# EAGLE design board (EAGLE 5.11)
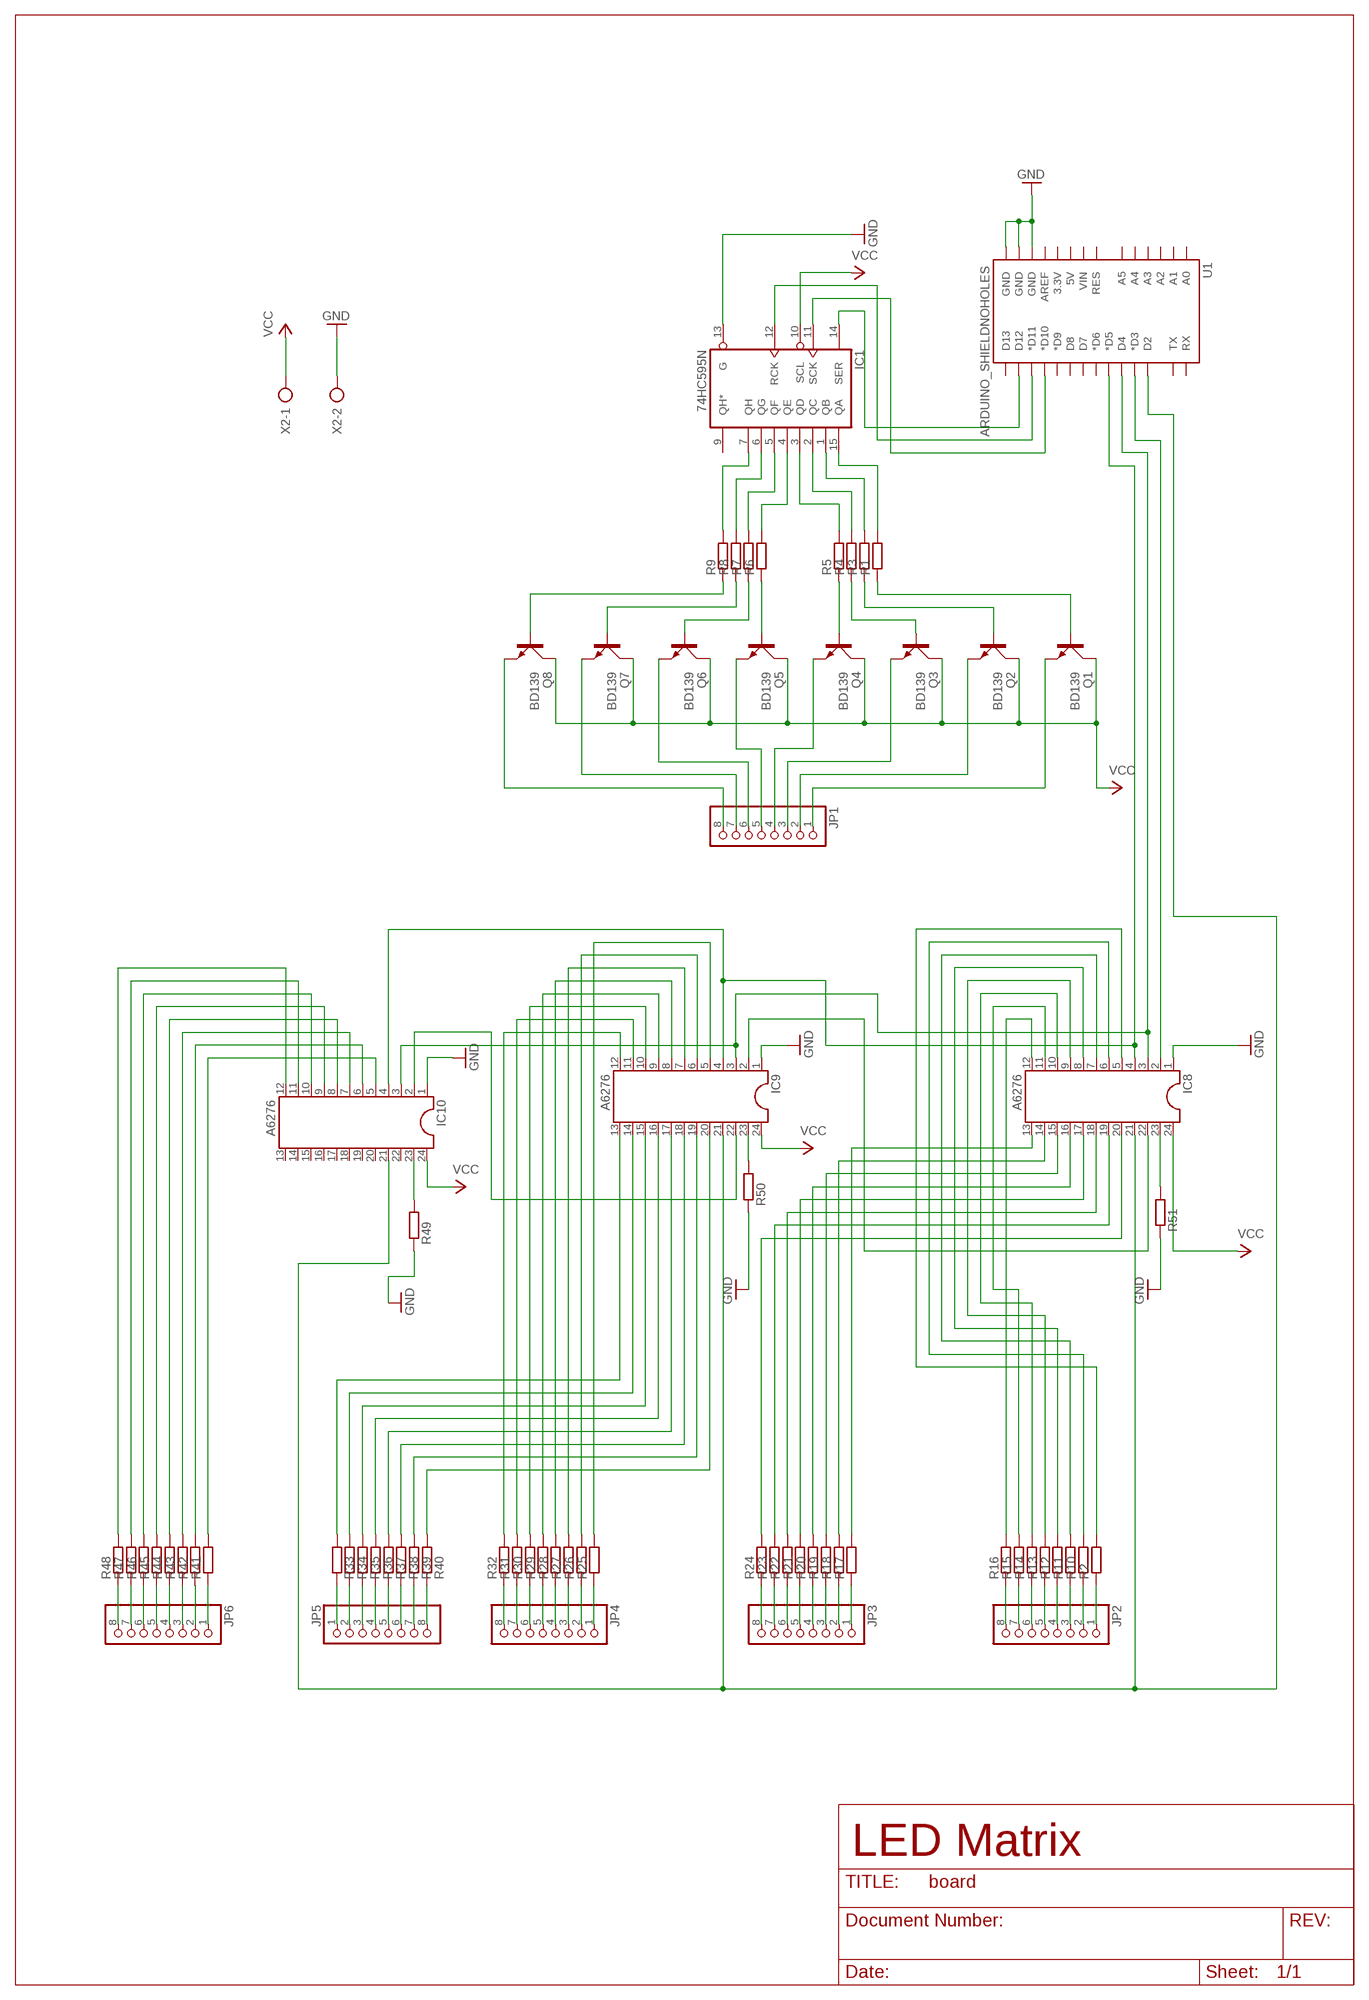
[diagram p0: schematic, sheet 1]

## Parts
IC1  74HC595N  [DIL16]
IC8  A6276  DIL24-3  [DIL24-3]
IC9  A6276  DIL24-3  [DIL24-3]
IC10  A6276  DIL24-3  [DIL24-3]
JP1  PINHD-1X8  [1X08]
JP2  PINHD-1X8  [1X08]
JP3  PINHD-1X8  [1X08]
JP4  PINHD-1X8  [1X08]
JP5  PINHD-1X8  [1X08]
JP6  PINHD-1X8  [1X08]
Q1  BD139  [TO126AV]
Q2  BD139  [TO126AV]
Q3  BD139  [TO126AV]
Q4  BD139  [TO126AV]
Q5  BD139  [TO126AV]
Q6  BD139  [TO126AV]
Q7  BD139  [TO126AV]
Q8  BD139  [TO126AV]
R1  R-EU_0204/7  [0204/7]
R2  R-EU_0204/7  [0204/7]
R3  R-EU_0204/7  [0204/7]
R4  R-EU_0204/7  [0204/7]
R5  R-EU_0204/7  [0204/7]
R6  R-EU_0204/7  [0204/7]
R7  R-EU_0204/7  [0204/7]
R8  R-EU_0204/7  [0204/7]
R9  R-EU_0204/7  [0204/7]
R10  R-EU_0204/7  [0204/7]
R11  R-EU_0204/7  [0204/7]
R12  R-EU_0204/7  [0204/7]
R13  R-EU_0204/7  [0204/7]
R14  R-EU_0204/7  [0204/7]
R15  R-EU_0204/7  [0204/7]
R16  R-EU_0204/7  [0204/7]
R17  R-EU_0204/7  [0204/7]
R18  R-EU_0204/7  [0204/7]
R19  R-EU_0204/7  [0204/7]
R20  R-EU_0204/7  [0204/7]
R21  R-EU_0204/7  [0204/7]
R22  R-EU_0204/7  [0204/7]
R23  R-EU_0204/7  [0204/7]
R24  R-EU_0204/7  [0204/7]
R25  R-EU_0204/7  [0204/7]
R26  R-EU_0204/7  [0204/7]
R27  R-EU_0204/7  [0204/7]
R28  R-EU_0204/7  [0204/7]
R29  R-EU_0204/7  [0204/7]
R30  R-EU_0204/7  [0204/7]
R31  R-EU_0204/7  [0204/7]
R32  R-EU_0204/7  [0204/7]
R33  R-EU_0204/7  [0204/7]
R34  R-EU_0204/7  [0204/7]
R35  R-EU_0204/7  [0204/7]
R36  R-EU_0204/7  [0204/7]
R37  R-EU_0204/7  [0204/7]
R38  R-EU_0204/7  [0204/7]
R39  R-EU_0204/7  [0204/7]
R40  R-EU_0204/7  [0204/7]
R41  R-EU_0204/7  [0204/7]
R42  R-EU_0204/7  [0204/7]
R43  R-EU_0204/7  [0204/7]
R44  R-EU_0204/7  [0204/7]
R45  R-EU_0204/7  [0204/7]
R46  R-EU_0204/7  [0204/7]
R47  R-EU_0204/7  [0204/7]
R48  R-EU_0204/7  [0204/7]
R49  R-EU_0204/7  [0204/7]
R50  R-EU_0204/7  [0204/7]
R51  R-EU_0204/7  [0204/7]
U1  ARDUINO_SHIELDNOHOLES  [DUEMILANOVE_SHIELD_NOHOLES]
X2  AK500/2  [AK500/2]

## Nets
GND: IC1.13(G) IC8.1 IC9.1 IC10.1 R49.1 R50.1 R51.1 U1.GND@0(GND) U1.GND@1(GND) U1.GND@2(GND) X2.2
N$1: Q1.B R1.1
N$2: JP1.1 Q1.E
N$3: Q2.B R3.1
N$4: Q3.B R4.1
N$5: Q4.B R5.1
N$6: Q5.B R6.1
N$7: Q6.B R7.1
N$8: Q7.B R8.1
N$9: Q8.B R9.1
N$10: JP1.2 Q2.E
N$11: JP1.3 Q3.E
N$12: JP1.4 Q4.E
N$14: JP1.5 Q5.E
N$15: JP1.6 Q6.E
N$16: JP1.7 Q7.E
N$17: JP2.1 R2.1
N$18: JP2.2 R10.1
N$19: JP2.3 R11.1
N$20: JP2.4 R12.1
N$21: JP2.5 R13.1
N$22: JP2.6 R14.1
N$23: JP2.7 R15.1
N$24: JP2.8 R16.1
N$25: JP3.1 R17.1
N$26: JP3.2 R18.1
N$27: JP3.3 R19.1
N$28: JP3.4 R20.1
N$29: JP3.5 R21.1
N$30: JP3.6 R22.1
N$31: IC8.19 R23.2
N$32: JP3.8 R24.1
N$33: JP4.1 R25.1
N$34: JP4.2 R26.1
N$35: JP4.3 R27.1
N$36: JP4.4 R28.1
N$37: JP4.5 R29.1
N$38: JP4.6 R30.1
N$39: JP4.7 R31.1
N$40: JP4.8 R32.1
N$41: JP5.1 R33.1
N$42: JP5.2 R34.1
N$43: JP5.3 R35.1
N$44: JP5.4 R36.1
N$45: JP5.5 R37.1
N$46: JP5.6 R38.1
N$47: JP5.7 R39.1
N$48: JP5.8 R40.1
N$49: JP6.1 R41.1
N$50: IC10.7 R43.2
N$51: JP6.3 R43.1
N$52: JP6.4 R44.1
N$53: JP6.5 R45.1
N$54: JP6.6 R46.1
N$55: JP6.7 R47.1
N$56: JP6.8 R48.1
N$57: IC8.22 IC9.2
N$58: IC9.22 IC10.2
N$59: IC10.23 R49.2
N$60: IC1.14(SER) U1.D12
N$61: IC9.23 R50.2
N$62: IC8.23 R51.2
N$63: IC1.11(SCK) U1.D10(*D10)
N$64: IC1.12(RCK) U1.D11(*D11)
N$65: IC1.7(QH) R9.2
N$67: IC1.15(QA) R1.2
N$69: IC1.2(QC) R4.2
N$70: IC1.3(QD) R5.2
N$72: IC1.6(QG) R8.2
N$76: IC8.4 IC9.4 IC10.4 U1.D5(*D5)
N$79: IC8.2 U1.D3(*D3)
N$84: IC8.7 R11.2
N$85: IC8.8 R12.2
N$86: IC8.9 R13.2
N$87: IC8.6 R10.2
N$88: IC8.5 R2.2
N$89: IC8.10 R14.2
N$90: IC8.11 R15.2
N$91: IC8.12 R16.2
N$92: IC9.5 R25.2
N$93: IC9.6 R26.2
N$94: IC9.7 R27.2
N$95: IC9.8 R28.2
N$96: IC9.9 R29.2
N$97: IC9.10 R30.2
N$98: IC9.11 R31.2
N$99: IC9.12 R32.2
N$100: IC8.13 R17.2
N$101: IC8.14 R18.2
N$102: IC8.15 R19.2
N$103: IC8.16 R20.2
N$104: IC8.17 R21.2
N$105: IC8.18 R22.2
N$106: JP3.7 R23.1
N$107: IC8.20 R24.2
N$108: IC9.13 R33.2
N$109: IC9.14 R34.2
N$110: IC9.15 R35.2
N$111: IC9.16 R36.2
N$112: IC9.17 R37.2
N$113: IC9.18 R38.2
N$114: IC9.19 R39.2
N$115: IC9.20 R40.2
N$116: IC10.8 R44.2
N$117: IC10.5 R41.2
N$118: IC10.9 R45.2
N$119: IC10.10 R46.2
N$120: IC10.11 R47.2
N$121: IC10.12 R48.2
N$122: IC10.6 R42.2
N$123: JP6.2 R42.1
N$132: JP1.8 Q8.E
N$134: IC1.4(QE) R6.2
N$136: IC1.1(QB) R3.2
N$138: IC8.21 IC9.21 IC10.21 U1.D2
N$141: IC1.5(QF) R7.2
N$146: IC8.3 IC9.3 IC10.3 U1.D4
VCC: IC1.10(SCL) IC8.24 IC9.24 IC10.24 Q1.C Q2.C Q3.C Q4.C Q5.C Q6.C Q7.C Q8.C X2.1
Unconnected: IC1.9(QH*) IC10.13 IC10.14 IC10.15 IC10.16 IC10.17 IC10.18 IC10.19 IC10.20 IC10.22 U1.3.3V U1.5V U1.A0 U1.A1 U1.A2 U1.A3 U1.A4 U1.A5 U1.AREF U1.D6(*D6) U1.D7 U1.D8 U1.D9(*D9) U1.D13 U1.RES U1.RX U1.TX U1.VIN

## Notes on the sheet
- LED Matrix

## Power pins joined to a net without a drawn wire
GND: IC1.8(GND)
VCC: IC1.16(VCC)

## Library data of the parts
IC1 = 74xx-eu:74*595: 8-bit SHIFT REGISTER, output latch
IC8-IC10 = ic-package:DIL24: Dual In Line
JP1-JP6 = pinhead:PINHD-1X8: PIN HEADER
Q1-Q8 = transistor-power:BD139: NPN TRANSISTOR
R1-R51 = rcl:R-EU_: RESISTOR, European symbol
U1 = SparkFun:ARDUINO_SHIELD
X2 = con-ptr500:AK500/2: CONNECTOR; OC_FARNELL: unknown; OC_NEWARK: unknown

## Board
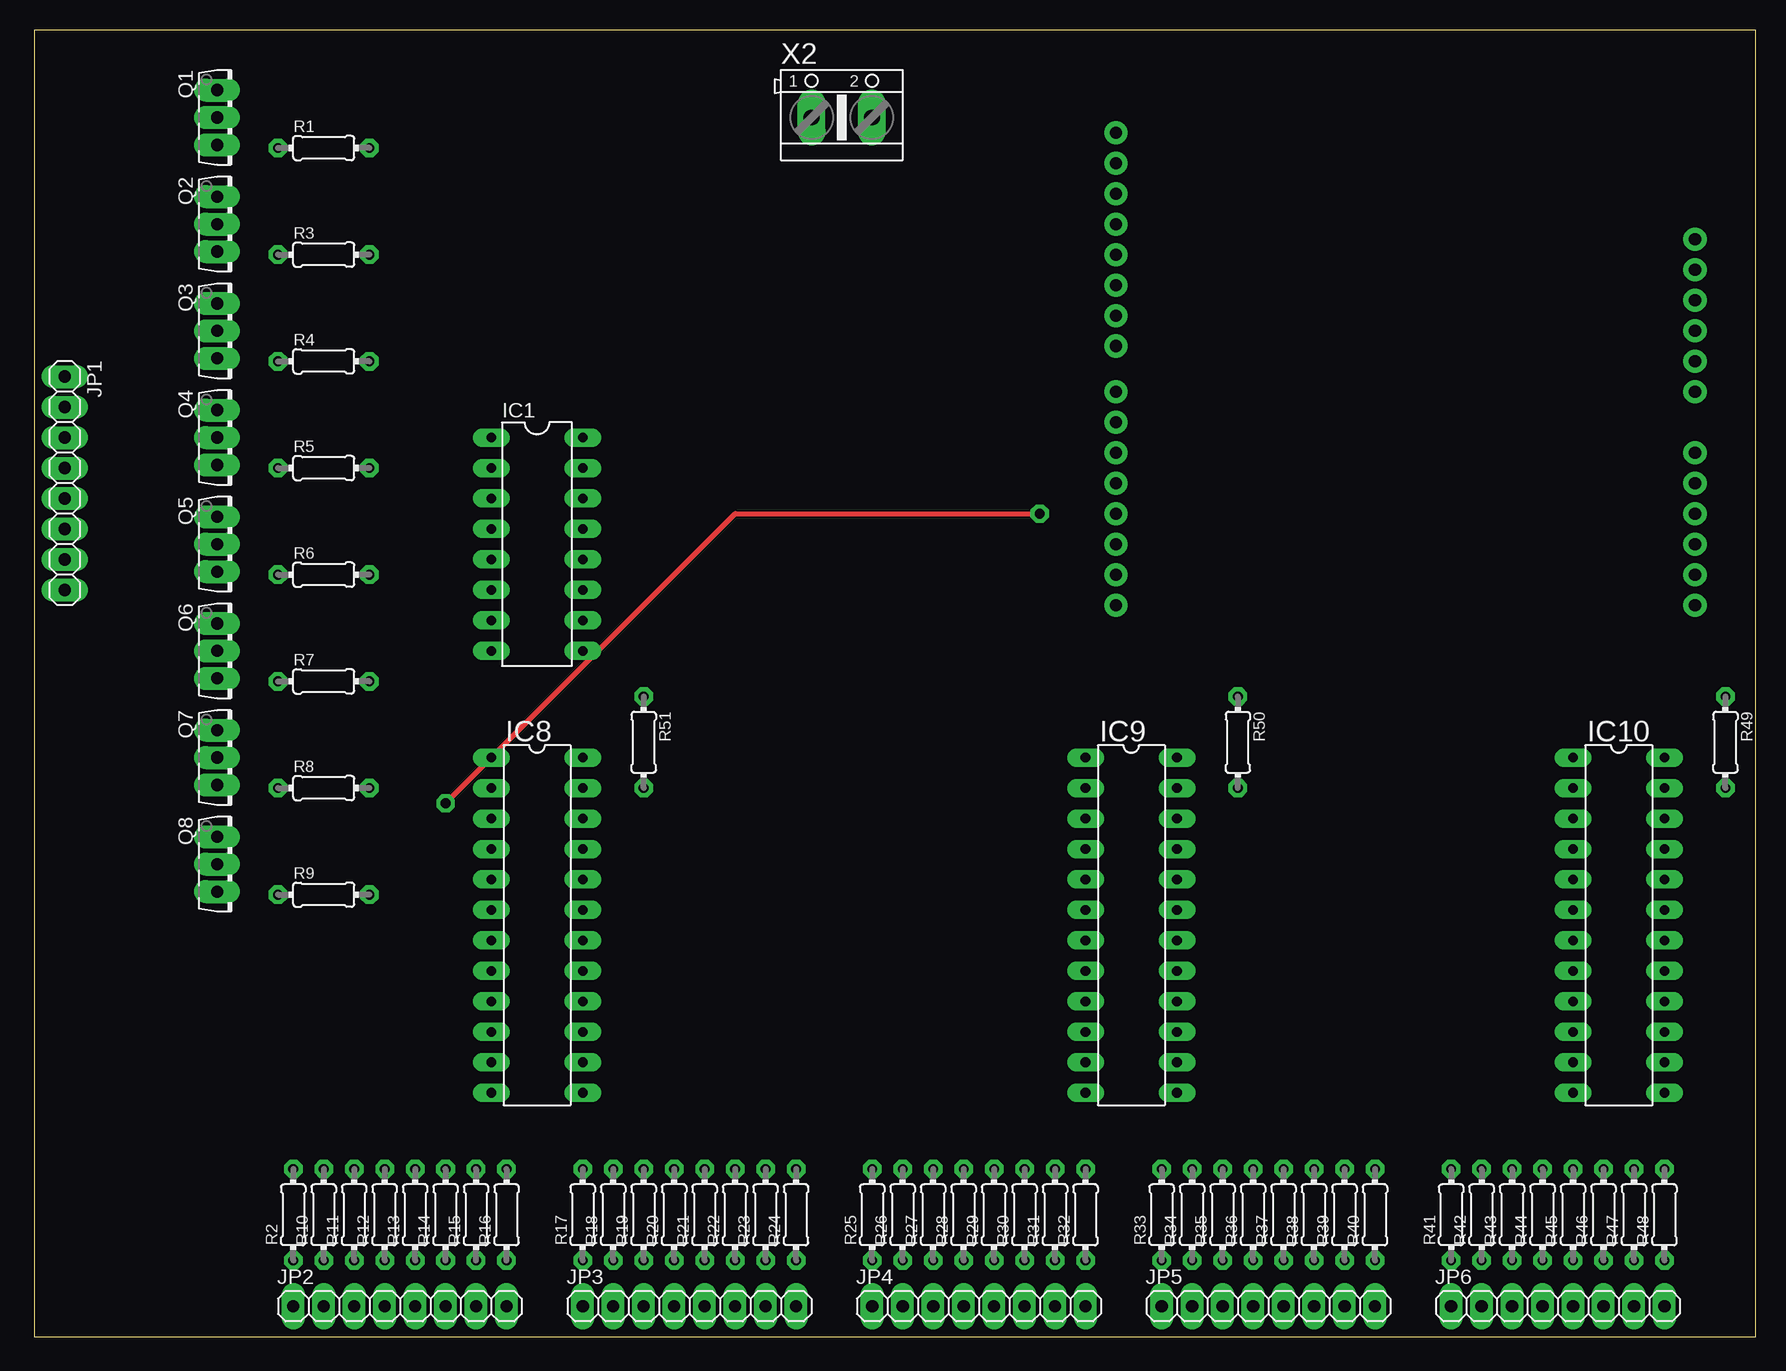
[diagram p1: board, top side]
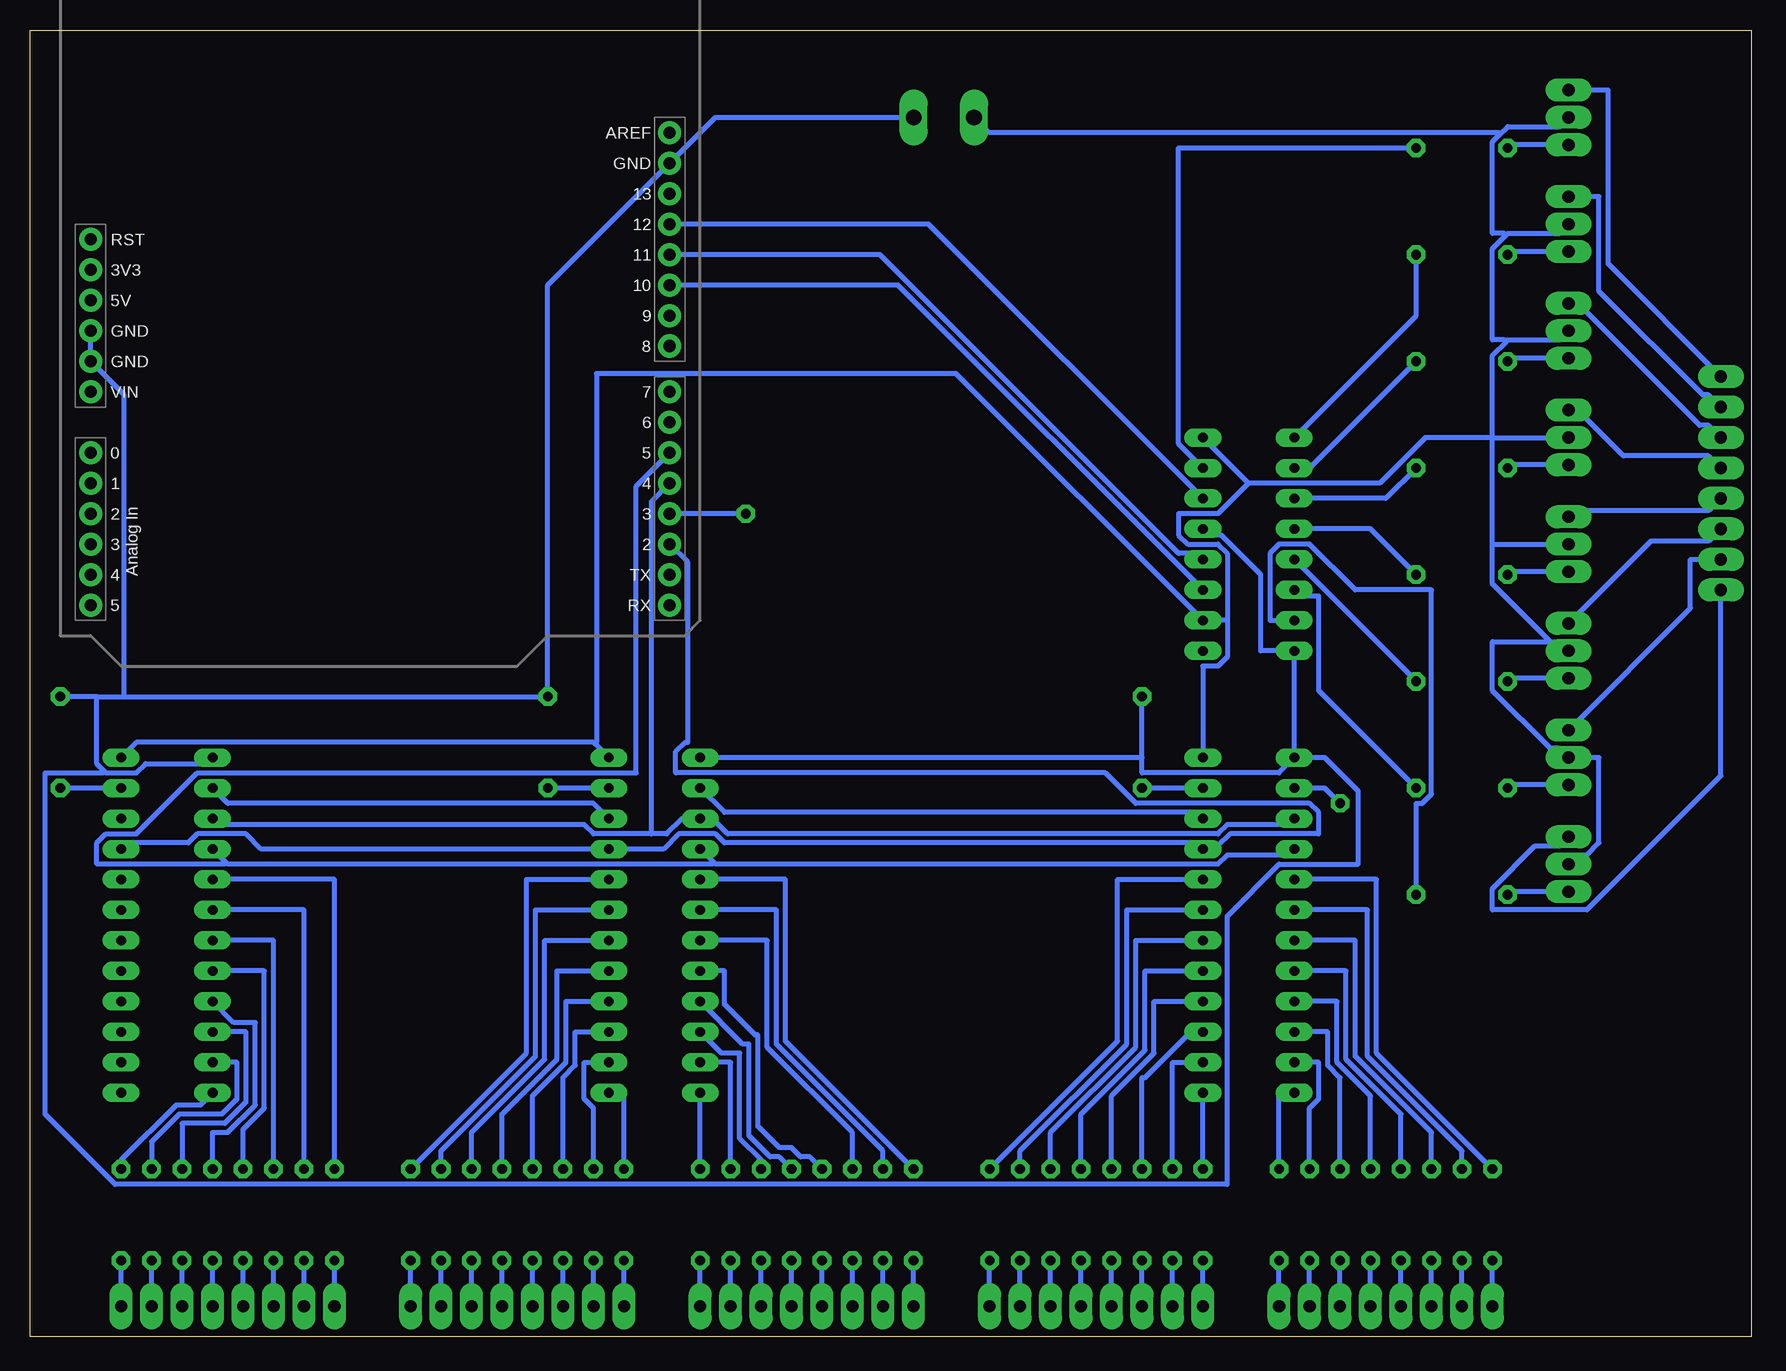
[diagram p2: board, bottom side, seen from below]

Size 143.49 x 108.89 mm. Coordinates in mm from the lower left corner, seen from the top.
Outline: 0,0 143.49,0 143.49,108.89 0,108.89 0,0
Copper layers (1*16): Top 0.035mm / dielectric 1.5mm / Bottom 0.035mm
Design rules "default *": minimum track width 16mil, minimum drill 24mil, track to track 8mil, track to pad 8mil, pad to pad 8mil, via to via 8mil, smd to smd 8mil, copper to edge 40mil, drill to drill 8mil, minimum pad ring 10mil, minimum via ring 8mil, stop-mask expansion 4mil, vias tented up to drill 0mil, thermal gap 10mil

### Footprints (pad centres in the part's own frame; a part is rotated, then mirrored left to right if it is on the bottom)
DIL16 = drill 0.813 long: 1 -8.89,-3.81; 2 -6.35,-3.81; 3 -3.81,-3.81; 4 -1.27,-3.81; 5 1.27,-3.81; 6 3.81,-3.81; 7 6.35,-3.81; 8 8.89,-3.81; 9 8.89,3.81; 10 6.35,3.81; 11 3.81,3.81; 12 1.27,3.81; 13 -1.27,3.81; 14 -3.81,3.81; 15 -6.35,3.81; 16 -8.89,3.81
DIL24-3 = drill 0.813 long: 1 -13.97,-3.81; 2 -11.43,-3.81; 3 -8.89,-3.81; 4 -6.35,-3.81; 5 -3.81,-3.81; 6 -1.27,-3.81; 7 1.27,-3.81; 8 3.81,-3.81; 9 6.35,-3.81; 10 8.89,-3.81; 11 11.43,-3.81; 12 13.97,-3.81; 13 13.97,3.81; 14 11.43,3.81; 15 8.89,3.81; 16 6.35,3.81; 17 3.81,3.81; 18 1.27,3.81; 19 -1.27,3.81; 20 -3.81,3.81; 21 -6.35,3.81; 22 -8.89,3.81; 23 -11.43,3.81; 24 -13.97,3.81
1X08 = drill 1.016 long: 1 -8.89,0; 2 -6.35,0; 3 -3.81,0; 4 -1.27,0; 5 1.27,0; 6 3.81,0; 7 6.35,0; 8 8.89,0
TO126AV = drill 1.016 long: B 2.286,-1.27; C 0,-1.27; E -2.286,-1.27
0204/7 = drill 0.813 octagon: 1 -3.81,0; 2 3.81,0
DUEMILANOVE_SHIELD_NOHOLES = drill 1.016 pad 1.88 round: 3.3V 50.8,26.67; 5V 50.8,29.21; A0 50.8,41.91; A1 50.8,44.45; A2 50.8,46.99; A3 50.8,49.53; A4 50.8,52.07; A5 50.8,54.61; AREF 2.54,15.24; D2 2.54,49.53; D3 2.54,46.99; D4 2.54,44.45; D5 2.54,41.91; D6 2.54,39.37; D7 2.54,36.83; D8 2.54,33.02; D9 2.54,30.48; D10 2.54,27.94; D11 2.54,25.4; D12 2.54,22.86; D13 2.54,20.32; GND@0 50.8,31.75; GND@1 50.8,34.29; GND@2 2.54,17.78; RES 50.8,24.13; RX 2.54,54.61; TX 2.54,52.07; VIN 50.8,36.83
AK500/2 = drill 1.321 long: 1 -2.515,0; 2 2.515,0

### Placement (x,y rotation side)
IC1  41.91,66.04 270 top
IC8  41.91,34.29 270 top
IC9  91.44,34.29 270 top
IC10  132.08,34.29 270 top
JP1  2.54,71.12 270 top
JP2  30.48,2.54 0 top
JP3  54.61,2.54 0 top
JP4  78.74,2.54 0 top
JP5  102.87,2.54 0 top
JP6  127,2.54 0 top
Q1  16.51,101.6 270 top
Q2  16.51,92.71 270 top
Q3  16.51,83.82 270 top
Q4  16.51,74.93 270 top
Q5  16.51,66.04 270 top
Q6  16.51,57.15 270 top
Q7  16.51,48.26 270 top
Q8  16.51,39.37 270 top
R1  24.13,99.06 0 top
R2  21.59,10.16 90 top
R3  24.13,90.17 0 top
R4  24.13,81.28 0 top
R5  24.13,72.39 0 top
R6  24.13,63.5 0 top
R7  24.13,54.61 0 top
R8  24.13,45.72 0 top
R9  24.13,36.83 0 top
R10  24.13,10.16 90 top
R11  26.67,10.16 90 top
R12  29.21,10.16 90 top
R13  31.75,10.16 90 top
R14  34.29,10.16 90 top
R15  36.83,10.16 90 top
R16  39.37,10.16 90 top
R17  45.72,10.16 90 top
R18  48.26,10.16 90 top
R19  50.8,10.16 90 top
R20  53.34,10.16 90 top
R21  55.88,10.16 90 top
R22  58.42,10.16 90 top
R23  60.96,10.16 90 top
R24  63.5,10.16 90 top
R25  69.85,10.16 90 top
R26  72.39,10.16 90 top
R27  74.93,10.16 90 top
R28  77.47,10.16 90 top
R29  80.01,10.16 90 top
R30  82.55,10.16 90 top
R31  85.09,10.16 90 top
R32  87.63,10.16 90 top
R33  93.98,10.16 90 top
R34  96.52,10.16 90 top
R35  99.06,10.16 90 top
R36  101.6,10.16 90 top
R37  104.14,10.16 90 top
R38  106.68,10.16 90 top
R39  109.22,10.16 90 top
R40  111.76,10.16 90 top
R41  118.11,10.16 90 top
R42  120.65,10.16 90 top
R43  123.19,10.16 90 top
R44  125.73,10.16 90 top
R45  128.27,10.16 90 top
R46  130.81,10.16 90 top
R47  133.35,10.16 90 top
R48  135.89,10.16 90 top
R49  140.97,49.53 270 top
R50  100.33,49.53 270 top
R51  50.8,49.53 270 top
U1  87.63,115.57 180 bottom
X2  67.31,101.6 0 top

### Tracks (layer width: path | path; a pad name or v marks a point on that pad's centre or on a via)
GND
  Bottom 0.406: IC8.1 IC1.8 40.89,57.15 40.89,63.5 44.2,66.8 45.21,66.8 IC1.13 | 50.8,48.26 50.8,46.99 39.37,46.99 IC8.1 | 50.8,48.26 R51.1 | 50.8,48.26 IC9.1 | X2.2 86.36,101.6 U1.GND@2 100.33,87.63 R50.1 135.64,53.34 | U1.GND@0 U1.GND@1 135.64,78.49 135.64,53.34 | 137.92,53.34 R49.1 | 137.92,53.34 135.64,53.34 | IC10.1 128.78,47.75 133.86,47.75 134.62,46.99 137.16,46.99 137.29,47.12 | 137.29,47.12 137.92,47.75 137.92,53.34 | IC8.1 35.56,48.26 32.77,45.47 32.77,39.37 39.37,39.37 43.69,35.05 43.69,12.7 136.4,12.7 142.24,18.54 142.24,46.99 137.41,46.99 137.29,47.12 | IC8.1 38.1,48.01
N$1
  Bottom 0.406: R1.1 20.07,99.31 Q1.B
N$2
  Bottom 0.406: JP1.1 11.94,89.41 11.94,103.89 Q1.E
N$3
  Bottom 0.406: R3.1 20.07,90.42 Q2.B
N$4
  Bottom 0.406: R4.1 20.07,81.53 Q3.B
N$5
  Bottom 0.406: R5.1 20.07,72.64 Q4.B
N$6
  Bottom 0.406: R6.1 20.07,63.75 Q5.B
N$7
  Bottom 0.406: R7.1 20.07,54.86 Q6.B
N$8
  Bottom 0.406: R8.1 20.07,45.97 Q7.B
N$9
  Bottom 0.406: R9.1 20.07,37.08 Q8.B
N$10
  Bottom 0.406: JP1.2 3.56,78.49 4.06,78.49 12.7,87.12 12.7,95 Q2.E
N$11
  Bottom 0.406: JP1.3 3.56,75.95 4.32,75.95 14.48,86.11 Q3.E
N$12
  Bottom 0.406: JP1.4 3.56,73.41 10.67,73.41 14.48,77.22 Q4.E
N$14
  Bottom 0.406: JP1.5 3.56,68.83 14.73,68.83 Q5.E
N$15
  Bottom 0.406: JP1.6 3.56,66.29 8.38,66.29 Q6.E
N$16
  Bottom 0.406: Q7.E 5.08,60.71 5.08,64.77 JP1.7
N$17
  Bottom 0.406: JP2.1 R2.1
N$18
  Bottom 0.406: JP2.2 R10.1
N$19
  Bottom 0.406: JP2.3 R11.1
N$20
  Bottom 0.406: JP2.4 R12.1
N$21
  Bottom 0.406: JP2.5 R13.1
N$22
  Bottom 0.406: JP2.6 R14.1
N$23
  Bottom 0.406: JP2.7 R15.1
N$24
  Bottom 0.406: JP2.8 R16.1
N$25
  Bottom 0.406: JP3.1 R17.1
N$26
  Bottom 0.406: JP3.2 R18.1
N$27
  Bottom 0.406: JP3.3 R19.1
N$28
  Bottom 0.406: JP3.4 R20.1
N$29
  Bottom 0.406: JP3.5 R21.1
N$30
  Bottom 0.406: JP3.6 R22.1
N$31
  Bottom 0.406: R23.2 60.96,15.49 52.07,24.38 52.07,35.56 IC8.19
N$32
  Bottom 0.406: JP3.8 R24.1
N$33
  Bottom 0.406: JP4.1 R25.1
N$34
  Bottom 0.406: JP4.2 R26.1
N$35
  Bottom 0.406: JP4.3 R27.1
N$36
  Bottom 0.406: JP4.4 R28.1
N$37
  Bottom 0.406: JP4.5 R29.1
N$38
  Bottom 0.406: JP4.6 R30.1
N$39
  Bottom 0.406: JP4.7 R31.1
N$40
  Bottom 0.406: JP4.8 R32.1
N$41
  Bottom 0.406: JP5.1 R33.1
N$42
  Bottom 0.406: JP5.2 R34.1
N$43
  Bottom 0.406: JP5.3 R35.1
N$44
  Bottom 0.406: JP5.4 R36.1
N$45
  Bottom 0.406: JP5.5 R37.1
N$46
  Bottom 0.406: JP5.6 R38.1
N$47
  Bottom 0.406: JP5.7 R39.1
N$48
  Bottom 0.406: JP5.8 R40.1
N$49
  Bottom 0.406: JP6.1 R41.1
N$50
  Bottom 0.406: R43.2 123.19,33.02 IC10.7
N$51
  Bottom 0.406: JP6.3 R43.1
N$52
  Bottom 0.406: JP6.4 R44.1
N$53
  Bottom 0.406: JP6.5 R45.1
N$54
  Bottom 0.406: JP6.6 R46.1
N$55
  Bottom 0.406: JP6.7 R47.1
N$56
  Bottom 0.406: JP6.8 R48.1
N$57
  Bottom 0.406: IC8.22 46.23,43.69 85.6,43.69 IC9.2
N$58
  Bottom 0.406: IC9.22 96.52,44.45 127,44.45 IC10.2
N$59
  Bottom 0.406: IC10.23 R49.2
N$60
  Bottom 0.406: IC1.14 68.58,92.71 U1.D12
N$61
  Bottom 0.406: IC9.23 R50.2
N$62
  Bottom 0.406: IC8.23 R51.2
N$63
  Bottom 0.406: IC1.11 71.12,87.63 U1.D10
N$64
  Bottom 0.406: IC1.12 46.23,65.28 47.75,65.28 72.64,90.17 U1.D11
N$65
  Bottom 0.406: R9.2 27.94,44.45 27.43,44.45 26.67,45.21 26.67,62.23 33.02,62.23 36.83,66.04 39.37,66.04 40.13,65.28 40.13,59.69 IC1.7
N$67
  Bottom 0.406: IC1.15 47.75,74.42 47.75,99.06 R1.2
N$69
  Bottom 0.406: R4.2 36.83,72.39 IC1.2
N$70
  Bottom 0.406: R5.2 30.48,69.85 IC1.3
N$72
  Bottom 0.406: R8.2 36.07,53.85 36.07,61.72 37.59,61.72 IC1.6
N$76
  Bottom 0.406: IC8.4 38.61,40.13 43.69,40.13 44.45,39.37 86.36,39.37 86.49,39.5 | 86.49,39.5 IC9.4 | 127.13,39.5 127,39.37 86.61,39.37 86.49,39.5 | 127.13,39.5 IC10.4 | U1.D5 92.96,70.87 92.96,46.99 129.54,46.99 134.62,41.91 137.16,41.91 137.92,41.15 137.92,39.37 127.25,39.37 127.13,39.5
N$79  (via drill 0.8)
  Top 0.406: v83.82,68.58 58.42,68.58 v34.29,44.45
  Bottom 0.406: IC8.2 35.56,45.72 v34.29,44.45 | v83.82,68.58 U1.D3
N$84
  Bottom 0.406: R11.2 26.67,17.02 33.02,23.37 33.02,33.02 IC8.7
N$85
  Bottom 0.406: R12.2 29.21,18.54 33.78,23.11 33.78,30.48 IC8.8
N$86
  Bottom 0.406: R13.2 31.75,20.07 34.54,22.86 34.54,27.94 IC8.9
N$87
  Bottom 0.406: R10.2 24.13,15.49 32,23.37 32,35.56 IC8.6
N$88
  Bottom 0.406: R2.2 31.24,23.62 31.24,38.1 IC8.5
N$89
  Bottom 0.406: R14.2 34.29,21.59 35.31,22.61 35.31,25.4 IC8.10
N$90
  Bottom 0.406: R15.2 36.83,19.05 36.07,19.81 36.07,22.86 IC8.11
N$91
  Bottom 0.406: R16.2 39.37,20.32 IC8.12
N$92
  Bottom 0.406: R25.2 80.52,24.64 80.52,38.1 IC9.5
N$93
  Bottom 0.406: R26.2 72.39,15.49 81.28,24.38 81.28,35.56 IC9.6
N$94
  Bottom 0.406: R27.2 74.93,17.02 82.04,24.13 82.04,33.02 IC9.7
N$95
  Bottom 0.406: R28.2 78.49,14.99 79.25,14.99 80.01,15.75 81.03,15.75 82.8,17.53 82.8,25.15 83.06,25.15 85.6,27.69 85.6,30.48 IC9.8
N$96
  Bottom 0.406: R29.2 81.03,14.99 81.79,14.99 83.57,16.76 83.57,24.38 84.07,24.38 IC9.9
N$97
  Bottom 0.406: R30.2 82.55,14.73 84.33,16.51 84.33,23.62 85.85,23.62 IC9.10
N$98
  Bottom 0.406: R31.2 85.09,22.86 IC9.11
N$99
  Bottom 0.406: R32.2 IC9.12
N$100
  Bottom 0.406: R17.2 IC8.13
N$101
  Bottom 0.406: R18.2 48.26,22.86 IC8.14
N$102
  Bottom 0.406: R19.2 50.8,21.59 50.55,21.59 46.74,25.4 IC8.15
N$103
  Bottom 0.406: R20.2 53.34,20.07 49.78,23.62 49.78,27.94 IC8.16
N$104
  Bottom 0.406: R21.2 55.88,18.54 50.55,23.88 50.55,30.48 IC8.17
N$105
  Bottom 0.406: R22.2 58.42,17.02 51.31,24.13 51.31,33.02 IC8.18
N$106
  Bottom 0.406: JP3.7 R23.1
N$107
  Bottom 0.406: R24.2 52.83,24.64 52.83,38.1 IC8.20
N$108
  Bottom 0.406: R33.2 93.98,20.32 IC9.13
N$109
  Bottom 0.406: R34.2 96.52,19.05 97.28,19.81 97.28,22.86 IC9.14
N$110
  Bottom 0.406: R35.2 99.06,21.59 98.04,22.61 98.04,25.4 IC9.15
N$111
  Bottom 0.406: R36.2 101.6,20.07 98.81,22.86 98.81,27.94 IC9.16
N$112
  Bottom 0.406: R37.2 104.14,18.54 99.57,23.11 99.57,30.48 IC9.17
N$113
  Bottom 0.406: R38.2 106.68,17.02 100.58,23.11 100.58,33.02 IC9.18
N$114
  Bottom 0.406: R39.2 109.22,15.49 101.35,23.37 101.35,35.56 IC9.19
N$115
  Bottom 0.406: R40.2 102.11,23.62 102.11,38.1 IC9.20
N$116
  Bottom 0.406: R44.2 125.73,17.27 123.95,19.05 123.95,30.48 IC10.8
N$117
  Bottom 0.406: R41.2 118.11,38.1 IC10.5
N$118
  Bottom 0.406: R45.2 128.27,17.02 127,17.02 124.71,19.3 124.71,26.16 126.49,26.16 IC10.9
N$119
  Bottom 0.406: R46.2 130.81,17.78 127.25,17.78 125.48,19.56 125.48,25.4 IC10.10
N$120
  Bottom 0.406: R47.2 133.35,16.26 131.06,18.54 127.51,18.54 126.24,19.81 126.24,22.86 IC10.11
N$121
  Bottom 0.406: IC10.12 129.29,19.3 131.32,19.3 135.89,14.73 R48.2
N$122
  Bottom 0.406: R42.2 120.65,35.56 IC10.6
N$123
  Bottom 0.406: JP6.2 R42.1
N$132
  Bottom 0.406: Q8.E 16,40.89 18.03,40.89 21.59,37.34 21.59,35.56 13.72,35.56 2.54,46.74 JP1.8
N$134
  Bottom 0.406: R6.2 31.75,67.31 IC1.4
N$136
  Bottom 0.406: IC1.1 27.94,85.09 R3.2
N$138
  Bottom 0.406: IC10.21 135.38,41.15 130.3,41.15 129.54,41.91 125.48,41.91 124.21,40.64 IC9.21 90.68,40.64 89.41,41.91 86.36,41.91 85.6,41.15 46.23,41.15 IC8.21 45.72,40.89 44.45,40.89 43.43,41.91 36.07,41.91 36.07,43.69 36.83,44.45 51.31,44.45 53.85,46.99 89.66,46.99 89.66,48.77 88.9,49.53 88.65,49.53 88.65,64.52 U1.D2
N$141
  Bottom 0.406: R7.2 IC1.5
N$146
  Bottom 0.406: IC8.3 38.61,42.67 43.69,42.67 44.45,41.91 85.34,41.91 86.61,43.18 IC9.3 89.15,43.18 90.42,41.91 91.69,41.91 | IC10.3 127.76,42.67 97.28,42.67 96.52,41.91 91.69,41.91 | U1.D4 91.69,69.6 91.69,41.91
VCC
  Bottom 0.406: 96.39,49.4 96.52,49.53 134.62,49.53 IC10.24 | 96.39,49.4 IC9.24 | Q8.C 14.48,40.13 13.72,40.13 12.7,41.15 12.7,48.26 Q7.C 16,49.02 16.76,49.02 21.59,53.85 21.59,57.91 17.02,57.91 16.89,58.04 | Q6.C 16,57.91 16.76,57.91 16.89,58.04 | 16.89,58.04 21.59,62.74 21.59,66.04 | 21.59,66.04 Q5.C | IC8.24 45.72,55.88 44.45,55.88 43.69,56.64 43.69,59.69 | 43.69,59.69 IC1.10 66.29,80.26 96.27,80.26 96.27,49.53 96.39,49.4 | 41.91,71.12 IC1.16 | 41.91,71.12 30.99,71.12 27.18,74.93 21.59,74.93 | 21.59,74.93 Q4.C | Q3.C 16,83.06 20.32,83.06 20.45,82.93 | 20.45,82.93 21.59,81.79 21.59,74.93 | Q2.C 16,91.95 20.32,91.95 20.45,91.82 | 20.45,91.82 21.59,90.68 21.59,83.06 20.57,83.06 20.45,82.93 | Q1.C 16,100.84 20.32,100.84 20.95,100.2 | 20.95,100.2 21.59,99.57 21.59,91.95 20.57,91.95 20.45,91.82 | X2.1 64.77,101.6 63.5,100.33 21.08,100.33 20.95,100.2 | 43.69,59.69 43.69,65.28 44.45,66.04 46.99,66.04 47.75,66.8 47.75,68.58 44.45,68.58 41.91,71.12 | 21.59,66.04 21.59,74.93